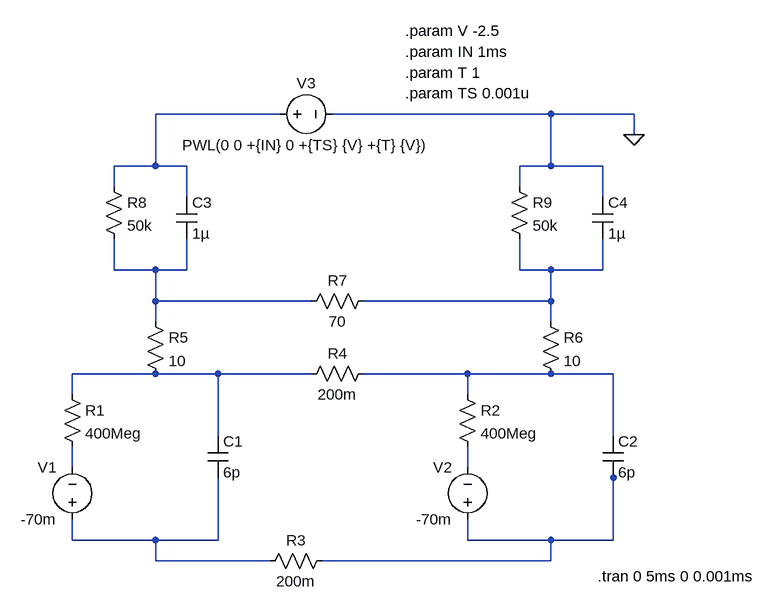
[diagram p0: schematic 電圧刺激等価回路_kai.asc]
電圧刺激等価回路_kai.asc, the LTspice schematic file:
Version 4
SHEET 1 1116 680
WIRE 320 -368 128 -368
WIRE 736 -368 400 -368
WIRE 864 -368 736 -368
WIRE 864 -336 864 -368
WIRE 128 -288 128 -368
WIRE 128 -288 64 -288
WIRE 176 -288 128 -288
WIRE 736 -288 736 -368
WIRE 736 -288 688 -288
WIRE 816 -288 736 -288
WIRE 64 -256 64 -288
WIRE 688 -256 688 -288
WIRE 176 -240 176 -288
WIRE 816 -240 816 -288
WIRE 64 -128 64 -176
WIRE 128 -128 64 -128
WIRE 176 -128 176 -176
WIRE 176 -128 128 -128
WIRE 688 -128 688 -176
WIRE 736 -128 688 -128
WIRE 816 -128 816 -176
WIRE 816 -128 736 -128
WIRE 128 -80 128 -128
WIRE 368 -80 128 -80
WIRE 736 -80 736 -128
WIRE 736 -80 448 -80
WIRE 128 -48 128 -80
WIRE 736 -48 736 -80
WIRE 128 32 0 32
WIRE 224 32 128 32
WIRE 368 32 224 32
WIRE 608 32 448 32
WIRE 736 32 608 32
WIRE 832 32 736 32
WIRE 0 64 0 32
WIRE 608 64 608 32
WIRE 224 128 224 32
WIRE 832 128 832 32
WIRE 0 176 0 144
WIRE 608 176 608 144
WIRE 832 192 832 176
WIRE 0 288 0 256
WIRE 128 288 0 288
WIRE 224 288 224 192
WIRE 224 288 128 288
WIRE 608 288 608 256
WIRE 736 288 608 288
WIRE 832 288 832 192
WIRE 832 288 736 288
WIRE 128 320 128 288
WIRE 304 320 128 320
WIRE 736 320 736 288
WIRE 736 320 384 320
FLAG 864 -336 0
SYMBOL voltage 304 -368 R270
WINDOW 0 32 56 VTop 2
WINDOW 3 -32 56 VBottom 2
WINDOW 123 0 0 Left 0
WINDOW 39 0 0 Left 0
SYMATTR InstName V3
SYMATTR Value PWL(0 0 +{IN} 0 +{TS} {V} +{T} {V})
SYMBOL res -16 48 R0
SYMATTR InstName R1
SYMATTR Value 400Meg
SYMBOL res 592 48 R0
SYMATTR InstName R2
SYMATTR Value 400Meg
SYMBOL res 400 304 R90
WINDOW 0 0 56 VBottom 2
WINDOW 3 32 56 VTop 2
SYMATTR InstName R3
SYMATTR Value 200m
SYMBOL res 112 -64 R0
SYMATTR InstName R5
SYMATTR Value 10
SYMBOL res 720 -64 R0
SYMATTR InstName R6
SYMATTR Value 10
SYMBOL cap 208 128 R0
SYMATTR InstName C1
SYMATTR Value 6p
SYMBOL cap 816 128 R0
SYMATTR InstName C2
SYMATTR Value 6p
SYMBOL cap 160 -240 R0
SYMATTR InstName C3
SYMATTR Value 1µ
SYMBOL cap 800 -240 R0
SYMATTR InstName C4
SYMATTR Value 1µ
SYMBOL res 48 -272 R0
SYMATTR InstName R8
SYMATTR Value 50k
SYMBOL res 672 -272 R0
SYMATTR InstName R9
SYMATTR Value 50k
SYMBOL voltage 0 272 R180
WINDOW 0 24 96 Left 2
WINDOW 3 24 16 Left 2
SYMATTR InstName V1
SYMATTR Value -70m
SYMBOL voltage 608 272 R180
WINDOW 0 24 96 Left 2
WINDOW 3 24 16 Left 2
SYMATTR InstName V2
SYMATTR Value -70m
SYMBOL res 464 16 R90
WINDOW 0 0 56 VBottom 2
WINDOW 3 32 56 VTop 2
SYMATTR InstName R4
SYMATTR Value 200m
SYMBOL res 464 -96 R90
WINDOW 0 0 56 VBottom 2
WINDOW 3 32 56 VTop 2
SYMATTR InstName R7
SYMATTR Value 70
TEXT 512 -496 Left 2 !.param V -2.5
TEXT 512 -464 Left 2 !.param IN 1ms
TEXT 512 -432 Left 2 !.param T 1
TEXT 808 344 Left 2 !.tran 0 5ms 0 0.001ms
TEXT 512 -400 Left 2 !.param TS 0.001u

The netlist it stands for:
* 電圧刺激等価回路_kai.asc
V3 N001 0 PWL(0 0 +{IN} 0 +{TS} {V} +{T} {V})
R1 N004 N006 400Meg
R2 N005 N007 400Meg
R3 N008 N009 200m
R5 N002 N004 10
R6 N003 N005 10
C1 N004 N009 6p
C2 N005 N008 6p
C3 N001 N002 1µ
C4 0 N003 1µ
R8 N001 N002 50k
R9 0 N003 50k
V1 N009 N006 -70m
V2 N008 N007 -70m
R4 N005 N004 200m
R7 N003 N002 70
.param V -2.5
.param IN 1ms
.param T 1
.tran 0 5ms 0 0.001ms
.param TS 0.001u
.backanno
.end